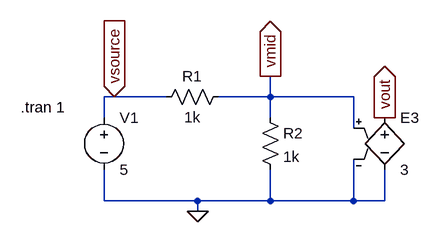
[diagram p0: schematic VCVS.asc]
VCVS.asc, the LTspice schematic file:
Version 4
SHEET 1 880 680
WIRE 48 112 32 112
WIRE 128 112 48 112
WIRE 288 112 288 80
WIRE 288 112 208 112
WIRE 416 112 288 112
WIRE 32 144 32 112
WIRE 288 144 288 112
WIRE 416 160 416 112
WIRE 32 272 32 224
WIRE 176 272 32 272
WIRE 288 272 288 224
WIRE 288 272 176 272
WIRE 416 272 416 208
WIRE 416 272 288 272
WIRE 464 272 464 224
WIRE 464 272 416 272
WIRE 176 288 176 272
FLAG 176 288 0
FLAG 464 144 vout
IOPIN 464 144 Out
FLAG 48 112 vsource
IOPIN 48 112 In
FLAG 288 80 vmid
IOPIN 288 80 Out
SYMBOL res 224 96 R90
WINDOW 0 0 56 VBottom 2
WINDOW 3 32 56 VTop 2
SYMATTR InstName R1
SYMATTR Value 1k
SYMBOL res 272 128 R0
SYMATTR InstName R2
SYMATTR Value 1k
SYMBOL voltage 32 128 R0
SYMATTR InstName V1
SYMATTR Value 5
SYMBOL e 464 128 R0
SYMATTR InstName E3
SYMATTR Value 3
TEXT -96 128 Left 2 !.tran 1

The netlist it stands for:
* VCVS.asc
R1 vmid vsource 1k
R2 vmid 0 1k
V1 vsource 0 5
E3 vout 0 vmid 0 3
.tran 1
.backanno
.end